# Altium schematic sheet 0805_array.SchDoc
size 594 x 420 mm; Address1: Address1; Address2: Address2; Address3: Address3; Address4: Address4; DocumentNumber: АБВГ.123456.001 Э3; SheetNumber: 2; SheetTotal: 3; Scale: 1:1; DocumentType: Схема электрическая принципиальная; FirstReferrence: АБВГ.123456.001
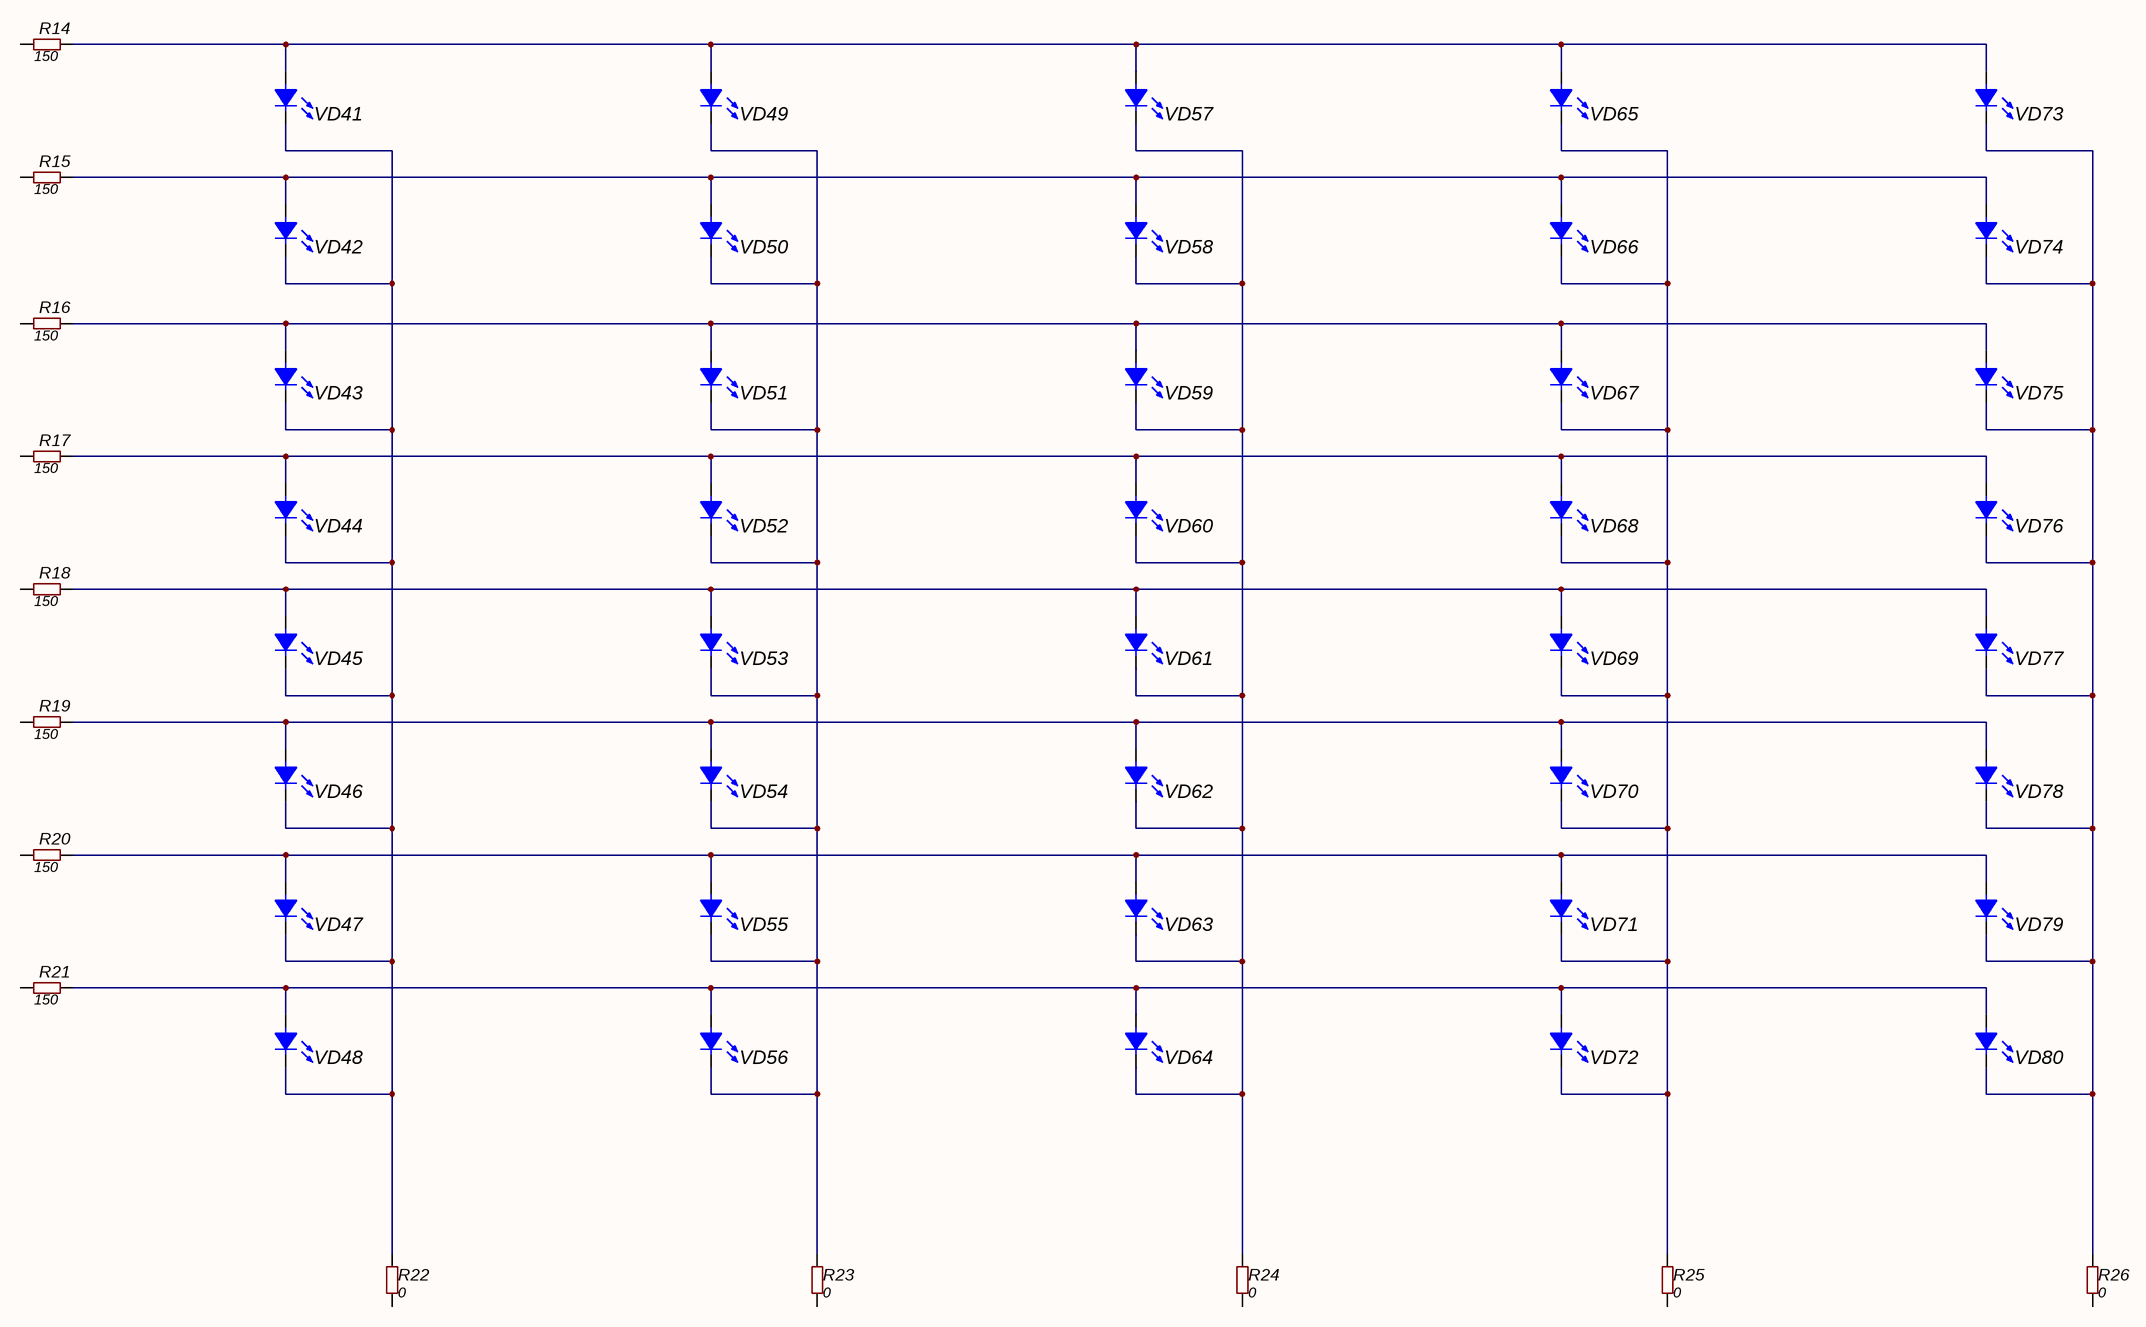
[diagram p0: 0805_array.SchDoc]

## Parts
R14  value 150  [RES: 0603]
R15  value 150  [RES: 0603]
R16  value 150  [RES: 0603]
R17  value 150  [RES: 0603]
R18  value 150  [RES: 0603]
R19  value 150  [RES: 0603]
R20  value 150  [RES: 0603]
R21  value 150  [RES: 0603]
R22  value 0  [RES: 0603]
R23  value 0  [RES: 0603]
R24  value 0  [RES: 0603]
R25  value 0  [RES: 0603]
R26  value 0  [RES: 0603]
VD41  (no value)  [LED: 0805Y]
VD42  (no value)  [LED: 0805Y]
VD43  (no value)  [LED: 0805Y]
VD44  (no value)  [LED: 0805Y]
VD45  (no value)  [LED: 0805Y]
VD46  (no value)  [LED: 0805Y]
VD47  (no value)  [LED: 0805Y]
VD48  (no value)  [LED: 0805Y]
VD49  (no value)  [LED: 0805Y]
VD50  (no value)  [LED: 0805Y]
VD51  (no value)  [LED: 0805Y]
VD52  (no value)  [LED: 0805Y]
VD53  (no value)  [LED: 0805Y]
VD54  (no value)  [LED: 0805Y]
VD55  (no value)  [LED: 0805Y]
VD56  (no value)  [LED: 0805Y]
VD57  (no value)  [LED: 0805Y]
VD58  (no value)  [LED: 0805Y]
VD59  (no value)  [LED: 0805Y]
VD60  (no value)  [LED: 0805Y]
VD61  (no value)  [LED: 0805Y]
VD62  (no value)  [LED: 0805Y]
VD63  (no value)  [LED: 0805Y]
VD64  (no value)  [LED: 0805Y]
VD65  (no value)  [LED: 0805Y]
VD66  (no value)  [LED: 0805Y]
VD67  (no value)  [LED: 0805Y]
VD68  (no value)  [LED: 0805Y]
VD69  (no value)  [LED: 0805Y]
VD70  (no value)  [LED: 0805Y]
VD71  (no value)  [LED: 0805Y]
VD72  (no value)  [LED: 0805Y]
VD73  (no value)  [LED: 0805Y]
VD74  (no value)  [LED: 0805Y]
VD75  (no value)  [LED: 0805Y]
VD76  (no value)  [LED: 0805Y]
VD77  (no value)  [LED: 0805Y]
VD78  (no value)  [LED: 0805Y]
VD79  (no value)  [LED: 0805Y]
VD80  (no value)  [LED: 0805Y]

## Nets
NetR14_2: R14.2 VD41.1(A) VD49.1(A) VD57.1(A) VD65.1(A) VD73.1(A)
NetR15_2: R15.2 VD42.1(A) VD50.1(A) VD58.1(A) VD66.1(A) VD74.1(A)
NetR16_2: R16.2 VD43.1(A) VD51.1(A) VD59.1(A) VD67.1(A) VD75.1(A)
NetR17_2: R17.2 VD44.1(A) VD52.1(A) VD60.1(A) VD68.1(A) VD76.1(A)
NetR18_2: R18.2 VD45.1(A) VD53.1(A) VD61.1(A) VD69.1(A) VD77.1(A)
NetR19_2: R19.2 VD46.1(A) VD54.1(A) VD62.1(A) VD70.1(A) VD78.1(A)
NetR20_2: R20.2 VD47.1(A) VD55.1(A) VD63.1(A) VD71.1(A) VD79.1(A)
NetR21_2: R21.2 VD48.1(A) VD56.1(A) VD64.1(A) VD72.1(A) VD80.1(A)
NetR22_2: R22.2 VD41.2(C) VD42.2(C) VD43.2(C) VD44.2(C) VD45.2(C) VD46.2(C) VD47.2(C) VD48.2(C)
NetR23_2: R23.2 VD49.2(C) VD50.2(C) VD51.2(C) VD52.2(C) VD53.2(C) VD54.2(C) VD55.2(C) VD56.2(C)
NetR24_2: R24.2 VD57.2(C) VD58.2(C) VD59.2(C) VD60.2(C) VD61.2(C) VD62.2(C) VD63.2(C) VD64.2(C)
NetR25_2: R25.2 VD65.2(C) VD66.2(C) VD67.2(C) VD68.2(C) VD69.2(C) VD70.2(C) VD71.2(C) VD72.2(C)
NetR26_2: R26.2 VD73.2(C) VD74.2(C) VD75.2(C) VD76.2(C) VD77.2(C) VD78.2(C) VD79.2(C) VD80.2(C)

Not connected (* = marked no-connect by the designer): R14 1; R15 1; R16 1; R17 1; R18 1; R19 1; R20 1; R21 1; R22 1; R23 1; R24 1; R25 1; R26 1

## Notes on the sheet
- Перв. примен.
- Справ. №
- Подп. и дата
- Инв. № дубл.
- Взам. инв. №
- Инв. № подл.
- Изм.
- Лист
- № докум.
- Подп.
- Дата
- 2.106-A2
- Копировал
- Формат А2

## Library data of the parts
R14-R26 = Resistor_0603: Manufacturer: Yageo; PartNumber: RC0603JR-07100RL; TypeResistor: Resistor film; Power: 0.1W; Package: 0603; HelpURL: https://www.digikey.com/product-detail/en/yageo/RC0603JR-07100RL/311-100GRCT-ND/729644; ValueManufacturerPartNumber: =TypeResistor+', '+Value+', '+Tolerance+', '+Package+', '+Power+', '+Temperature; Temperature: -55...+125°C
VD41-VD80 = LED_single: ValueManufacturerPartNumber: LED, Green, *, *, *, -55...+150°C; TypeDiode: LED; ColorParameter: Green; Manufacturer: *; Package: *; HelpURL: *; Temperature: -55...+150°C; Current: *; VoltageDrop: *; PartNumber: *; Color: GREEN